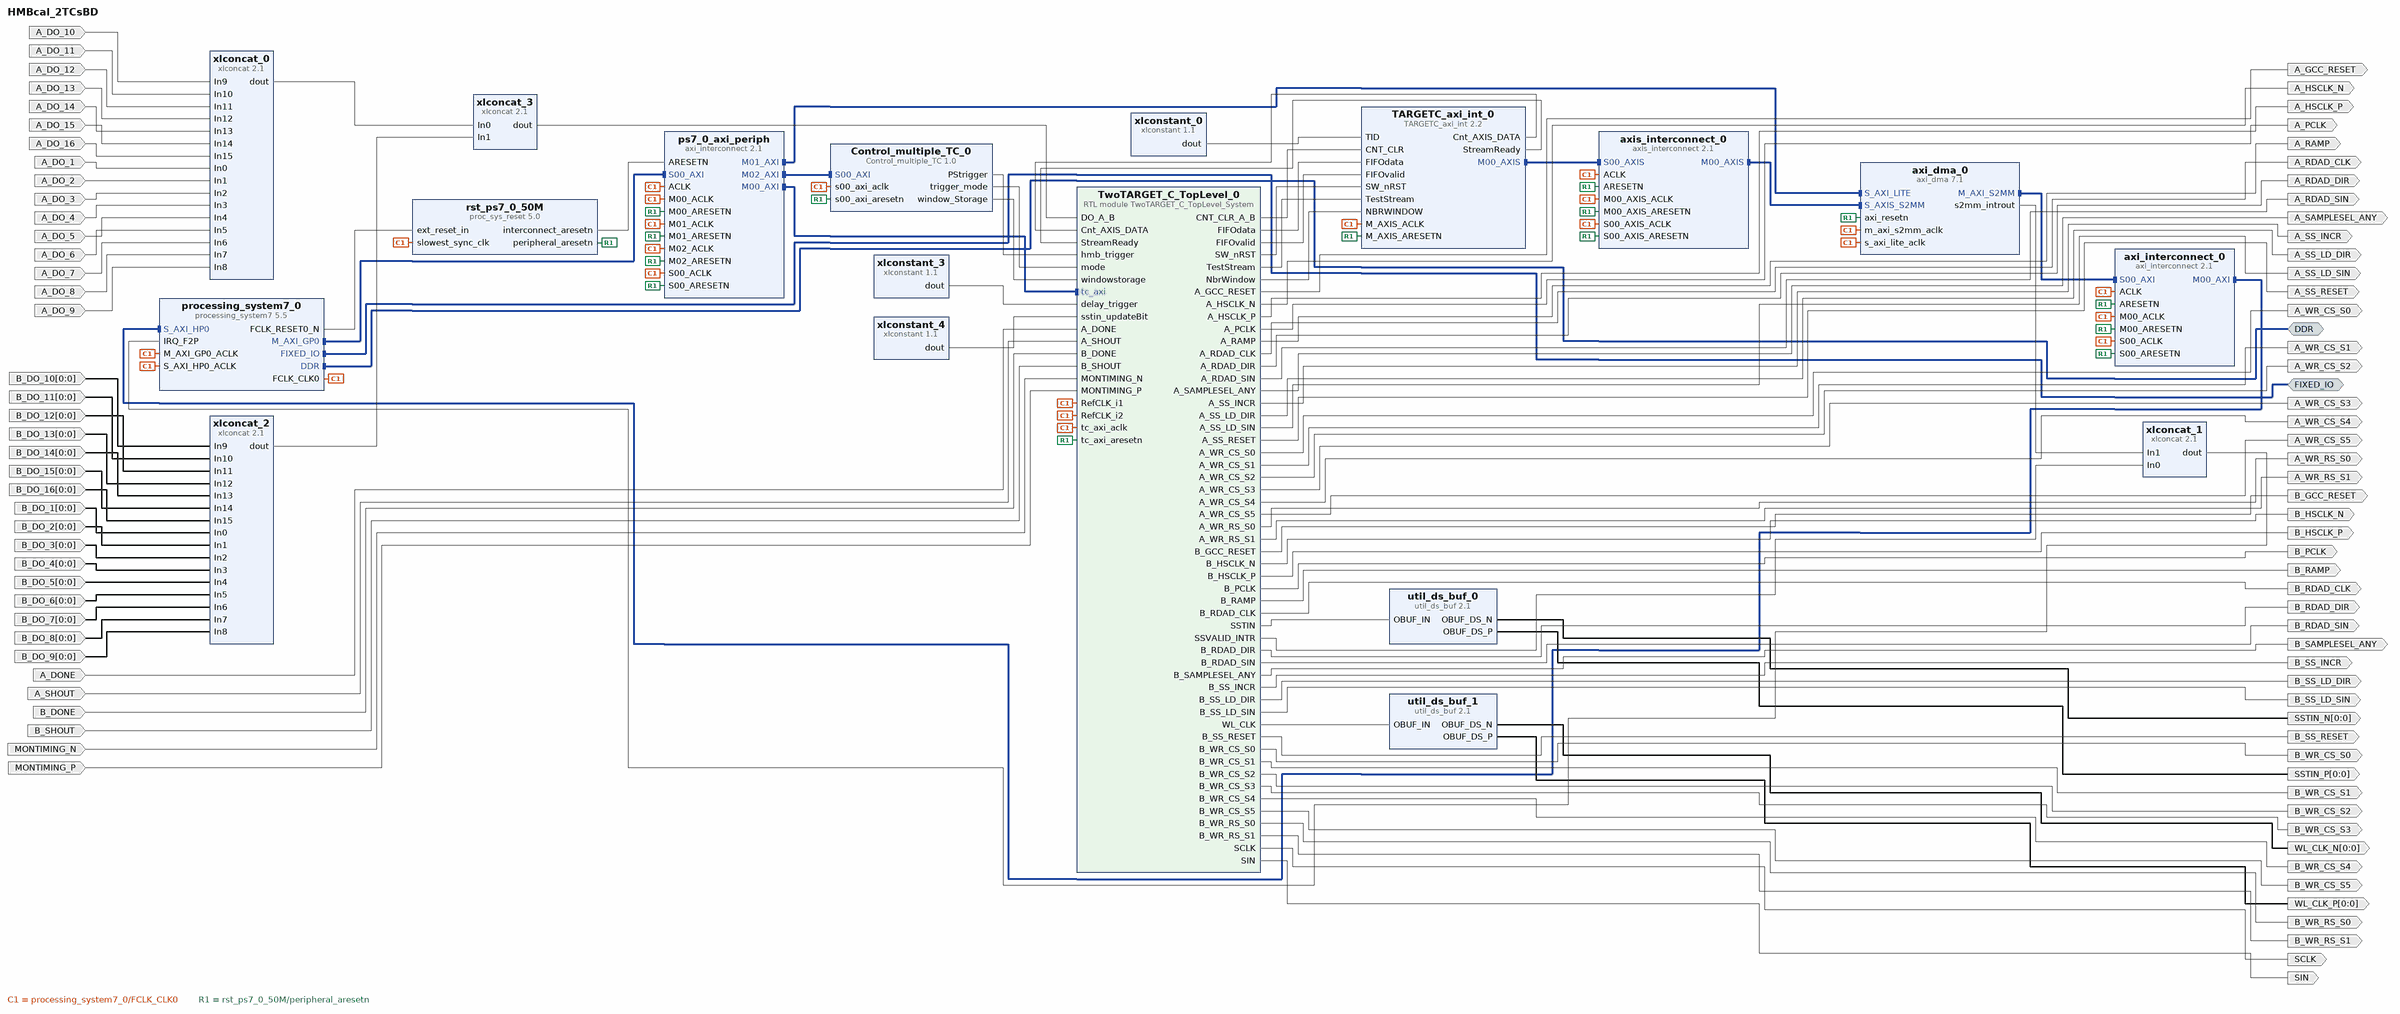
[diagram p0: block diagram of the top level]
# Vivado block design HMBcal_2TCsBD, xc7z020clg400-1, Vivado 2020.2
create_bd_design HMBcal_2TCsBD

create_bd_intf_port -mode Master -vlnv xilinx.com:interface:ddrx_rtl:1.0 DDR
create_bd_intf_port -mode Master -vlnv xilinx.com:display_processing_system7:fixedio_rtl:1.0 FIXED_IO
create_bd_port -dir I A_DONE
create_bd_port -dir I A_DO_1
create_bd_port -dir I A_DO_2
create_bd_port -dir I A_DO_3
create_bd_port -dir I A_DO_4
create_bd_port -dir I A_DO_5
create_bd_port -dir I A_DO_6
create_bd_port -dir I A_DO_7
create_bd_port -dir I A_DO_8
create_bd_port -dir I A_DO_9
create_bd_port -dir I A_DO_10
create_bd_port -dir I A_DO_11
create_bd_port -dir I A_DO_12
create_bd_port -dir I A_DO_13
create_bd_port -dir I A_DO_14
create_bd_port -dir I A_DO_15
create_bd_port -dir I A_DO_16
create_bd_port -dir O A_GCC_RESET
create_bd_port -dir O A_HSCLK_N
create_bd_port -dir O A_HSCLK_P
create_bd_port -dir O A_PCLK
create_bd_port -dir O A_RAMP
create_bd_port -dir O A_RDAD_CLK
create_bd_port -dir O A_RDAD_DIR
create_bd_port -dir O A_RDAD_SIN
create_bd_port -dir O A_SAMPLESEL_ANY
create_bd_port -dir I A_SHOUT
create_bd_port -dir O A_SS_INCR
create_bd_port -dir O A_SS_LD_DIR
create_bd_port -dir O A_SS_LD_SIN
create_bd_port -dir O -type rst A_SS_RESET
create_bd_port -dir O A_WR_CS_S0
create_bd_port -dir O A_WR_CS_S1
create_bd_port -dir O A_WR_CS_S2
create_bd_port -dir O A_WR_CS_S3
create_bd_port -dir O A_WR_CS_S4
create_bd_port -dir O A_WR_CS_S5
create_bd_port -dir O A_WR_RS_S0
create_bd_port -dir O A_WR_RS_S1
create_bd_port -dir I B_DONE
create_bd_port -dir I -from 0 -to 0 B_DO_1
create_bd_port -dir I -from 0 -to 0 B_DO_2
create_bd_port -dir I -from 0 -to 0 -type data B_DO_3
create_bd_port -dir I -from 0 -to 0 -type data B_DO_4
create_bd_port -dir I -from 0 -to 0 -type data B_DO_5
create_bd_port -dir I -from 0 -to 0 -type data B_DO_6
create_bd_port -dir I -from 0 -to 0 -type data B_DO_7
create_bd_port -dir I -from 0 -to 0 -type data B_DO_8
create_bd_port -dir I -from 0 -to 0 -type data B_DO_9
create_bd_port -dir I -from 0 -to 0 -type data B_DO_10
create_bd_port -dir I -from 0 -to 0 -type data B_DO_11
create_bd_port -dir I -from 0 -to 0 B_DO_12
create_bd_port -dir I -from 0 -to 0 -type data B_DO_13
create_bd_port -dir I -from 0 -to 0 -type data B_DO_14
create_bd_port -dir I -from 0 -to 0 -type data B_DO_15
create_bd_port -dir I -from 0 -to 0 -type data B_DO_16
create_bd_port -dir O -type data B_GCC_RESET
create_bd_port -dir O -type data B_HSCLK_N
create_bd_port -dir O -type data B_HSCLK_P
create_bd_port -dir O B_PCLK
create_bd_port -dir O -type data B_RAMP
create_bd_port -dir O -type data B_RDAD_CLK
create_bd_port -dir O -type data B_RDAD_DIR
create_bd_port -dir O -type data B_RDAD_SIN
create_bd_port -dir O -type data B_SAMPLESEL_ANY
create_bd_port -dir I B_SHOUT
create_bd_port -dir O -type data B_SS_INCR
create_bd_port -dir O -type clk B_SS_LD_DIR
create_bd_port -dir O -type clk B_SS_LD_SIN
create_bd_port -dir O -type rst B_SS_RESET
create_bd_port -dir O -type data B_WR_CS_S0
create_bd_port -dir O -type data B_WR_CS_S1
create_bd_port -dir O -type data B_WR_CS_S2
create_bd_port -dir O -type data B_WR_CS_S3
create_bd_port -dir O -type data B_WR_CS_S4
create_bd_port -dir O B_WR_CS_S5
create_bd_port -dir O B_WR_RS_S0
create_bd_port -dir O B_WR_RS_S1
create_bd_port -dir I MONTIMING_N
create_bd_port -dir I MONTIMING_P
create_bd_port -dir O SCLK
create_bd_port -dir O SIN
create_bd_port -dir O -from 0 -to 0 SSTIN_N
create_bd_port -dir O -from 0 -to 0 SSTIN_P
create_bd_port -dir O -from 0 -to 0 -type clk WL_CLK_N
create_bd_port -dir O -from 0 -to 0 -type clk WL_CLK_P

create_bd_cell -type ip -vlnv user.org:user:Control_multiple_TC:1.0 Control_multiple_TC_0
create_bd_cell -type ip -vlnv xilinx.com:ip:axi_dma:7.1 axi_dma_0
set_property -dict [list \
  CONFIG.c_include_mm2s 0 \
  CONFIG.c_include_s2mm 1 \
  CONFIG.c_include_s2mm_dre 0 \
  CONFIG.c_include_sg 0 \
  CONFIG.c_micro_dma 0 \
  CONFIG.c_s2mm_burst_size 128 \
  CONFIG.c_sg_length_width 14 \
] [get_bd_cells axi_dma_0]
create_bd_cell -type ip -vlnv xilinx.com:ip:axi_interconnect:2.1 axi_interconnect_0
set_property -dict {CONFIG.ENABLE_ADVANCED_OPTIONS 0 CONFIG.NUM_MI 1} [get_bd_cells axi_interconnect_0]
create_bd_cell -type ip -vlnv xilinx.com:ip:axis_interconnect:2.1 axis_interconnect_0
set_property -dict [list \
  CONFIG.ARB_ON_MAX_XFERS 0 \
  CONFIG.ARB_ON_TLAST 0 \
  CONFIG.ENABLE_ADVANCED_OPTIONS 0 \
  CONFIG.M00_FIFO_DEPTH 64 \
  CONFIG.M00_FIFO_MODE 0 \
  CONFIG.NUM_MI 1 \
  CONFIG.NUM_SI 1 \
  CONFIG.S00_FIFO_DEPTH 32 \
  CONFIG.S01_FIFO_DEPTH 32 \
] [get_bd_cells axis_interconnect_0]
create_bd_cell -type ip -vlnv xilinx.com:ip:processing_system7:5.5 processing_system7_0
set_property -dict [list \
  CONFIG.PCW_APU_PERIPHERAL_FREQMHZ 666.666666 \
  CONFIG.PCW_ENET0_ENET0_IO {MIO 16 .. 27} \
  CONFIG.PCW_ENET0_GRP_MDIO_ENABLE 1 \
  CONFIG.PCW_ENET0_GRP_MDIO_IO {MIO 52 .. 53} \
  CONFIG.PCW_ENET0_PERIPHERAL_ENABLE 1 \
  CONFIG.PCW_ENET0_PERIPHERAL_FREQMHZ {100 Mbps} \
  CONFIG.PCW_ENET0_RESET_ENABLE 0 \
  CONFIG.PCW_ENET_RESET_ENABLE 1 \
  CONFIG.PCW_ENET_RESET_SELECT {Share reset pin} \
  CONFIG.PCW_FPGA0_PERIPHERAL_FREQMHZ 125 \
  CONFIG.PCW_FPGA1_PERIPHERAL_FREQMHZ 100 \
  CONFIG.PCW_GPIO_MIO_GPIO_ENABLE 1 \
  CONFIG.PCW_GPIO_MIO_GPIO_IO MIO \
  CONFIG.PCW_I2C_RESET_ENABLE 0 \
  CONFIG.PCW_IRQ_F2P_INTR 1 \
  CONFIG.PCW_PERIPHERAL_BOARD_PRESET part0 \
  CONFIG.PCW_PRESET_BANK1_VOLTAGE {LVCMOS 1.8V} \
  CONFIG.PCW_QSPI_GRP_FBCLK_ENABLE 1 \
  CONFIG.PCW_QSPI_GRP_FBCLK_IO {MIO 8} \
  CONFIG.PCW_QSPI_GRP_SINGLE_SS_ENABLE 1 \
  CONFIG.PCW_QSPI_GRP_SINGLE_SS_IO {MIO 1 .. 6} \
  CONFIG.PCW_QSPI_PERIPHERAL_ENABLE 1 \
  CONFIG.PCW_QSPI_QSPI_IO {MIO 1 .. 6} \
  CONFIG.PCW_SD0_GRP_CD_ENABLE 1 \
  CONFIG.PCW_SD0_GRP_CD_IO {MIO 46} \
  CONFIG.PCW_SD0_GRP_WP_ENABLE 1 \
  CONFIG.PCW_SD0_GRP_WP_IO {MIO 50} \
  CONFIG.PCW_SD0_PERIPHERAL_ENABLE 1 \
  CONFIG.PCW_SD0_SD0_IO {MIO 40 .. 45} \
  CONFIG.PCW_SDIO_PERIPHERAL_FREQMHZ 50 \
  CONFIG.PCW_SINGLE_QSPI_DATA_MODE x4 \
  CONFIG.PCW_S_AXI_HP0_DATA_WIDTH 32 \
  CONFIG.PCW_TTC0_PERIPHERAL_ENABLE 1 \
  CONFIG.PCW_TTC0_TTC0_IO EMIO \
  CONFIG.PCW_UART1_PERIPHERAL_ENABLE 1 \
  CONFIG.PCW_UART1_UART1_IO {MIO 48 .. 49} \
  CONFIG.PCW_UART_PERIPHERAL_FREQMHZ 50 \
  CONFIG.PCW_UIPARAM_DDR_FREQ_MHZ 533.333333 \
  CONFIG.PCW_UIPARAM_DDR_PARTNO {MT41K256M16 RE-125} \
  CONFIG.PCW_USB0_PERIPHERAL_ENABLE 0 \
  CONFIG.PCW_USB_RESET_ENABLE 1 \
  CONFIG.PCW_USE_FABRIC_INTERRUPT 1 \
  CONFIG.PCW_USE_S_AXI_HP0 1 \
  CONFIG.preset ZC702 \
] [get_bd_cells processing_system7_0]
# 511 more settings of processing_system7_0 are not shown: defaults, MIO pin electricals, DDR timing, and values the tool derives
create_bd_cell -type ip -vlnv xilinx.com:ip:axi_interconnect:2.1 ps7_0_axi_periph
set_property -dict {CONFIG.NUM_MI 3 CONFIG.NUM_SI 1} [get_bd_cells ps7_0_axi_periph]
create_bd_cell -type ip -vlnv xilinx.com:ip:util_ds_buf:2.1 util_ds_buf_0
set_property -dict {CONFIG.C_BUF_TYPE OBUFDS} [get_bd_cells util_ds_buf_0]
create_bd_cell -type ip -vlnv xilinx.com:ip:util_ds_buf:2.1 util_ds_buf_1
set_property -dict {CONFIG.C_BUF_TYPE OBUFDS} [get_bd_cells util_ds_buf_1]
create_bd_cell -type ip -vlnv xilinx.com:ip:xlconcat:2.1 xlconcat_0
set_property -dict {CONFIG.NUM_PORTS 16} [get_bd_cells xlconcat_0]
create_bd_cell -type ip -vlnv xilinx.com:ip:xlconcat:2.1 xlconcat_1
set_property -dict {CONFIG.NUM_PORTS 2} [get_bd_cells xlconcat_1]
create_bd_cell -type ip -vlnv xilinx.com:ip:xlconcat:2.1 xlconcat_2
set_property -dict {CONFIG.NUM_PORTS 16} [get_bd_cells xlconcat_2]
create_bd_cell -type ip -vlnv xilinx.com:ip:xlconcat:2.1 xlconcat_3
set_property -dict {CONFIG.IN0_WIDTH 16 CONFIG.IN1_WIDTH 16 CONFIG.NUM_PORTS 2} [get_bd_cells xlconcat_3]
create_bd_cell -type ip -vlnv xilinx.com:ip:xlconstant:1.1 xlconstant_0
set_property -dict {CONFIG.CONST_VAL 0 CONFIG.CONST_WIDTH 2} [get_bd_cells xlconstant_0]
create_bd_cell -type ip -vlnv xilinx.com:ip:xlconstant:1.1 xlconstant_3
set_property -dict {CONFIG.CONST_WIDTH 4} [get_bd_cells xlconstant_3]
create_bd_cell -type ip -vlnv xilinx.com:ip:xlconstant:1.1 xlconstant_4
set_property -dict {CONFIG.CONST_VAL 3 CONFIG.CONST_WIDTH 3} [get_bd_cells xlconstant_4]
create_bd_cell -type ip -vlnv xilinx.com:ip:proc_sys_reset:5.0 rst_ps7_0_50M
create_bd_cell -type ip -vlnv user.org:user:TARGETC_axi_int:2.2 TARGETC_axi_int_0
set_property -dict {CONFIG.FIFO_NBR_MAX 1030 CONFIG.NBRWINDOW_MAX 8} [get_bd_cells TARGETC_axi_int_0]
create_bd_cell -type module -reference TwoTARGET_C_TopLevel_System TwoTARGET_C_TopLevel_0

# ---- connections ----

connect_bd_intf_net [get_bd_intf_pins TARGETC_axi_int_0/M00_AXIS] [get_bd_intf_pins axis_interconnect_0/S00_AXIS]
connect_bd_intf_net [get_bd_intf_ports FIXED_IO] [get_bd_intf_pins processing_system7_0/FIXED_IO]
connect_bd_intf_net [get_bd_intf_pins processing_system7_0/M_AXI_GP0] [get_bd_intf_pins ps7_0_axi_periph/S00_AXI]
connect_bd_intf_net [get_bd_intf_pins axi_dma_0/S_AXI_LITE] [get_bd_intf_pins ps7_0_axi_periph/M01_AXI]
connect_bd_intf_net [get_bd_intf_pins Control_multiple_TC_0/S00_AXI] [get_bd_intf_pins ps7_0_axi_periph/M02_AXI]
connect_bd_intf_net [get_bd_intf_ports DDR] [get_bd_intf_pins processing_system7_0/DDR]
connect_bd_intf_net [get_bd_intf_pins axi_dma_0/M_AXI_S2MM] [get_bd_intf_pins axi_interconnect_0/S00_AXI]
connect_bd_intf_net [get_bd_intf_pins TwoTARGET_C_TopLevel_0/tc_axi] [get_bd_intf_pins ps7_0_axi_periph/M00_AXI]
connect_bd_intf_net [get_bd_intf_pins axi_interconnect_0/M00_AXI] [get_bd_intf_pins processing_system7_0/S_AXI_HP0]
connect_bd_intf_net [get_bd_intf_pins axi_dma_0/S_AXIS_S2MM] [get_bd_intf_pins axis_interconnect_0/M00_AXIS]
connect_bd_net -net B_DO_10_1 [get_bd_ports B_DO_10] [get_bd_pins xlconcat_2/In9]
connect_bd_net -net B_DO_11_1 [get_bd_ports B_DO_11] [get_bd_pins xlconcat_2/In10]
connect_bd_net -net B_DO_12_1 [get_bd_ports B_DO_12] [get_bd_pins xlconcat_2/In11]
connect_bd_net [get_bd_ports B_DO_13] [get_bd_pins xlconcat_2/In12]
connect_bd_net -net B_DO_14_1 [get_bd_ports B_DO_14] [get_bd_pins xlconcat_2/In13]
connect_bd_net -net B_DO_15_1 [get_bd_ports B_DO_15] [get_bd_pins xlconcat_2/In14]
connect_bd_net -net B_DO_16_1 [get_bd_ports B_DO_16] [get_bd_pins xlconcat_2/In15]
connect_bd_net -net B_DO_1_1 [get_bd_ports B_DO_1] [get_bd_pins xlconcat_2/In0]
connect_bd_net -net B_DO_2_1 [get_bd_ports B_DO_2] [get_bd_pins xlconcat_2/In1]
connect_bd_net -net B_DO_3_1 [get_bd_ports B_DO_3] [get_bd_pins xlconcat_2/In2]
connect_bd_net -net B_DO_4_1 [get_bd_ports B_DO_4] [get_bd_pins xlconcat_2/In3]
connect_bd_net -net B_DO_5_1 [get_bd_ports B_DO_5] [get_bd_pins xlconcat_2/In4]
connect_bd_net -net B_DO_6_1 [get_bd_ports B_DO_6] [get_bd_pins xlconcat_2/In5]
connect_bd_net -net B_DO_7_1 [get_bd_ports B_DO_7] [get_bd_pins xlconcat_2/In6]
connect_bd_net -net B_DO_8_1 [get_bd_ports B_DO_8] [get_bd_pins xlconcat_2/In7]
connect_bd_net -net B_DO_9_1 [get_bd_ports B_DO_9] [get_bd_pins xlconcat_2/In8]
connect_bd_net -net Control_multiple_TC_0_PStrigger [get_bd_pins Control_multiple_TC_0/PStrigger] [get_bd_pins TwoTARGET_C_TopLevel_0/hmb_trigger]
connect_bd_net [get_bd_pins Control_multiple_TC_0/trigger_mode] [get_bd_pins TwoTARGET_C_TopLevel_0/mode]
connect_bd_net [get_bd_pins Control_multiple_TC_0/window_Storage] [get_bd_pins TwoTARGET_C_TopLevel_0/windowstorage]
connect_bd_net -net DO_10_1 [get_bd_ports A_DO_10] [get_bd_pins xlconcat_0/In9]
connect_bd_net -net DO_11_1 [get_bd_ports A_DO_11] [get_bd_pins xlconcat_0/In10]
connect_bd_net -net DO_12_1 [get_bd_ports A_DO_12] [get_bd_pins xlconcat_0/In11]
connect_bd_net -net DO_13_1 [get_bd_ports A_DO_13] [get_bd_pins xlconcat_0/In12]
connect_bd_net -net DO_14_1 [get_bd_ports A_DO_14] [get_bd_pins xlconcat_0/In13]
connect_bd_net -net DO_15_1 [get_bd_ports A_DO_15] [get_bd_pins xlconcat_0/In14]
connect_bd_net -net DO_16_1 [get_bd_ports A_DO_16] [get_bd_pins xlconcat_0/In15]
connect_bd_net -net DO_1_1 [get_bd_ports A_DO_1] [get_bd_pins xlconcat_0/In0]
connect_bd_net -net DO_2_1 [get_bd_ports A_DO_2] [get_bd_pins xlconcat_0/In1]
connect_bd_net -net DO_3_1 [get_bd_ports A_DO_3] [get_bd_pins xlconcat_0/In2]
connect_bd_net -net DO_4_1 [get_bd_ports A_DO_4] [get_bd_pins xlconcat_0/In3]
connect_bd_net -net DO_5_1 [get_bd_ports A_DO_5] [get_bd_pins xlconcat_0/In4]
connect_bd_net -net DO_6_1 [get_bd_ports A_DO_6] [get_bd_pins xlconcat_0/In5]
connect_bd_net -net DO_7_1 [get_bd_ports A_DO_7] [get_bd_pins xlconcat_0/In6]
connect_bd_net -net DO_8_1 [get_bd_ports A_DO_8] [get_bd_pins xlconcat_0/In7]
connect_bd_net -net DO_9_1 [get_bd_ports A_DO_9] [get_bd_pins xlconcat_0/In8]
connect_bd_net [get_bd_pins TARGETC_axi_int_0/Cnt_AXIS_DATA] [get_bd_pins TwoTARGET_C_TopLevel_0/Cnt_AXIS_DATA]
connect_bd_net [get_bd_pins TARGETC_axi_int_0/StreamReady] [get_bd_pins TwoTARGET_C_TopLevel_0/StreamReady]
connect_bd_net -net TwoTARGET_C_TopLevel_0_A_DONE [get_bd_ports A_DONE] [get_bd_pins TwoTARGET_C_TopLevel_0/A_DONE]
connect_bd_net [get_bd_pins TwoTARGET_C_TopLevel_0/A_GCC_RESET] [get_bd_ports A_GCC_RESET]
connect_bd_net [get_bd_pins TwoTARGET_C_TopLevel_0/A_HSCLK_N] [get_bd_ports A_HSCLK_N]
connect_bd_net [get_bd_pins TwoTARGET_C_TopLevel_0/A_HSCLK_P] [get_bd_ports A_HSCLK_P]
connect_bd_net [get_bd_pins TwoTARGET_C_TopLevel_0/A_PCLK] [get_bd_ports A_PCLK]
connect_bd_net [get_bd_pins TwoTARGET_C_TopLevel_0/A_RAMP] [get_bd_ports A_RAMP]
connect_bd_net [get_bd_pins TwoTARGET_C_TopLevel_0/A_RDAD_CLK] [get_bd_ports A_RDAD_CLK]
connect_bd_net [get_bd_pins TwoTARGET_C_TopLevel_0/A_RDAD_DIR] [get_bd_ports A_RDAD_DIR]
connect_bd_net [get_bd_pins TwoTARGET_C_TopLevel_0/A_RDAD_SIN] [get_bd_ports A_RDAD_SIN]
connect_bd_net [get_bd_pins TwoTARGET_C_TopLevel_0/A_SAMPLESEL_ANY] [get_bd_ports A_SAMPLESEL_ANY]
connect_bd_net -net TwoTARGET_C_TopLevel_0_A_SHOUT [get_bd_ports A_SHOUT] [get_bd_pins TwoTARGET_C_TopLevel_0/A_SHOUT]
connect_bd_net [get_bd_pins TwoTARGET_C_TopLevel_0/A_SS_INCR] [get_bd_ports A_SS_INCR]
connect_bd_net [get_bd_pins TwoTARGET_C_TopLevel_0/A_SS_LD_DIR] [get_bd_ports A_SS_LD_DIR]
connect_bd_net [get_bd_pins TwoTARGET_C_TopLevel_0/A_SS_LD_SIN] [get_bd_ports A_SS_LD_SIN]
connect_bd_net [get_bd_pins TwoTARGET_C_TopLevel_0/A_SS_RESET] [get_bd_ports A_SS_RESET]
connect_bd_net [get_bd_pins TwoTARGET_C_TopLevel_0/A_WR_CS_S0] [get_bd_ports A_WR_CS_S0]
connect_bd_net [get_bd_pins TwoTARGET_C_TopLevel_0/A_WR_CS_S1] [get_bd_ports A_WR_CS_S1]
connect_bd_net [get_bd_pins TwoTARGET_C_TopLevel_0/A_WR_CS_S2] [get_bd_ports A_WR_CS_S2]
connect_bd_net [get_bd_pins TwoTARGET_C_TopLevel_0/A_WR_CS_S3] [get_bd_ports A_WR_CS_S3]
connect_bd_net [get_bd_pins TwoTARGET_C_TopLevel_0/A_WR_CS_S4] [get_bd_ports A_WR_CS_S4]
connect_bd_net [get_bd_pins TwoTARGET_C_TopLevel_0/A_WR_CS_S5] [get_bd_ports A_WR_CS_S5]
connect_bd_net [get_bd_pins TwoTARGET_C_TopLevel_0/A_WR_RS_S0] [get_bd_ports A_WR_RS_S0]
connect_bd_net [get_bd_pins TwoTARGET_C_TopLevel_0/A_WR_RS_S1] [get_bd_ports A_WR_RS_S1]
connect_bd_net -net TwoTARGET_C_TopLevel_0_B_DONE [get_bd_ports B_DONE] [get_bd_pins TwoTARGET_C_TopLevel_0/B_DONE]
connect_bd_net [get_bd_pins TwoTARGET_C_TopLevel_0/B_GCC_RESET] [get_bd_ports B_GCC_RESET]
connect_bd_net [get_bd_pins TwoTARGET_C_TopLevel_0/B_HSCLK_N] [get_bd_ports B_HSCLK_N]
connect_bd_net [get_bd_pins TwoTARGET_C_TopLevel_0/B_HSCLK_P] [get_bd_ports B_HSCLK_P]
connect_bd_net [get_bd_pins TwoTARGET_C_TopLevel_0/B_PCLK] [get_bd_ports B_PCLK]
connect_bd_net [get_bd_pins TwoTARGET_C_TopLevel_0/B_RAMP] [get_bd_ports B_RAMP]
connect_bd_net [get_bd_pins TwoTARGET_C_TopLevel_0/B_RDAD_CLK] [get_bd_ports B_RDAD_CLK]
connect_bd_net [get_bd_pins TwoTARGET_C_TopLevel_0/B_RDAD_DIR] [get_bd_ports B_RDAD_DIR]
connect_bd_net [get_bd_pins TwoTARGET_C_TopLevel_0/B_RDAD_SIN] [get_bd_ports B_RDAD_SIN]
connect_bd_net [get_bd_pins TwoTARGET_C_TopLevel_0/B_SAMPLESEL_ANY] [get_bd_ports B_SAMPLESEL_ANY]
connect_bd_net -net TwoTARGET_C_TopLevel_0_B_SHOUT [get_bd_ports B_SHOUT] [get_bd_pins TwoTARGET_C_TopLevel_0/B_SHOUT]
connect_bd_net [get_bd_pins TwoTARGET_C_TopLevel_0/B_SS_INCR] [get_bd_ports B_SS_INCR]
connect_bd_net [get_bd_pins TwoTARGET_C_TopLevel_0/B_SS_LD_DIR] [get_bd_ports B_SS_LD_DIR]
connect_bd_net [get_bd_pins TwoTARGET_C_TopLevel_0/B_SS_LD_SIN] [get_bd_ports B_SS_LD_SIN]
connect_bd_net [get_bd_pins TwoTARGET_C_TopLevel_0/B_SS_RESET] [get_bd_ports B_SS_RESET]
connect_bd_net [get_bd_pins TwoTARGET_C_TopLevel_0/B_WR_CS_S0] [get_bd_ports B_WR_CS_S0]
connect_bd_net [get_bd_pins TwoTARGET_C_TopLevel_0/B_WR_CS_S1] [get_bd_ports B_WR_CS_S1]
connect_bd_net [get_bd_pins TwoTARGET_C_TopLevel_0/B_WR_CS_S2] [get_bd_ports B_WR_CS_S2]
connect_bd_net [get_bd_pins TwoTARGET_C_TopLevel_0/B_WR_CS_S3] [get_bd_ports B_WR_CS_S3]
connect_bd_net [get_bd_pins TwoTARGET_C_TopLevel_0/B_WR_CS_S4] [get_bd_ports B_WR_CS_S4]
connect_bd_net [get_bd_pins TwoTARGET_C_TopLevel_0/B_WR_CS_S5] [get_bd_ports B_WR_CS_S5]
connect_bd_net [get_bd_pins TwoTARGET_C_TopLevel_0/B_WR_RS_S0] [get_bd_ports B_WR_RS_S0]
connect_bd_net [get_bd_pins TwoTARGET_C_TopLevel_0/B_WR_RS_S1] [get_bd_ports B_WR_RS_S1]
connect_bd_net [get_bd_pins TwoTARGET_C_TopLevel_0/CNT_CLR_A_B] [get_bd_pins TARGETC_axi_int_0/CNT_CLR]
connect_bd_net [get_bd_pins TwoTARGET_C_TopLevel_0/FIFOdata] [get_bd_pins TARGETC_axi_int_0/FIFOdata]
connect_bd_net [get_bd_pins TwoTARGET_C_TopLevel_0/FIFOvalid] [get_bd_pins TARGETC_axi_int_0/FIFOvalid]
connect_bd_net -net TwoTARGET_C_TopLevel_0_MONTIMING_N [get_bd_ports MONTIMING_N] [get_bd_pins TwoTARGET_C_TopLevel_0/MONTIMING_N]
connect_bd_net -net TwoTARGET_C_TopLevel_0_MONTIMING_P [get_bd_ports MONTIMING_P] [get_bd_pins TwoTARGET_C_TopLevel_0/MONTIMING_P]
connect_bd_net [get_bd_pins TwoTARGET_C_TopLevel_0/SCLK] [get_bd_ports SCLK]
connect_bd_net [get_bd_pins TwoTARGET_C_TopLevel_0/SIN] [get_bd_ports SIN]
connect_bd_net [get_bd_pins TwoTARGET_C_TopLevel_0/SSTIN] [get_bd_pins util_ds_buf_0/OBUF_IN]
connect_bd_net [get_bd_pins TwoTARGET_C_TopLevel_0/SSVALID_INTR] [get_bd_pins xlconcat_1/In0]
connect_bd_net [get_bd_pins TwoTARGET_C_TopLevel_0/SW_nRST] [get_bd_pins TARGETC_axi_int_0/SW_nRST]
connect_bd_net [get_bd_pins TwoTARGET_C_TopLevel_0/TestStream] [get_bd_pins TARGETC_axi_int_0/TestStream]
connect_bd_net [get_bd_pins TwoTARGET_C_TopLevel_0/WL_CLK] [get_bd_pins util_ds_buf_1/OBUF_IN]
connect_bd_net [get_bd_pins axi_dma_0/s2mm_introut] [get_bd_pins xlconcat_1/In1]
connect_bd_net [get_bd_pins processing_system7_0/FCLK_CLK0] \
  [get_bd_pins Control_multiple_TC_0/s00_axi_aclk] [get_bd_pins axi_dma_0/m_axi_s2mm_aclk] \
  [get_bd_pins axi_dma_0/s_axi_lite_aclk] [get_bd_pins axi_interconnect_0/ACLK] [get_bd_pins axi_interconnect_0/M00_ACLK] \
  [get_bd_pins axi_interconnect_0/S00_ACLK] [get_bd_pins axis_interconnect_0/ACLK] \
  [get_bd_pins axis_interconnect_0/M00_AXIS_ACLK] [get_bd_pins axis_interconnect_0/S00_AXIS_ACLK] \
  [get_bd_pins processing_system7_0/M_AXI_GP0_ACLK] [get_bd_pins processing_system7_0/S_AXI_HP0_ACLK] \
  [get_bd_pins ps7_0_axi_periph/ACLK] [get_bd_pins ps7_0_axi_periph/M00_ACLK] [get_bd_pins ps7_0_axi_periph/M01_ACLK] \
  [get_bd_pins ps7_0_axi_periph/M02_ACLK] [get_bd_pins ps7_0_axi_periph/S00_ACLK] \
  [get_bd_pins rst_ps7_0_50M/slowest_sync_clk] [get_bd_pins TARGETC_axi_int_0/M_AXIS_ACLK] \
  [get_bd_pins TwoTARGET_C_TopLevel_0/RefCLK_i1] [get_bd_pins TwoTARGET_C_TopLevel_0/RefCLK_i2] \
  [get_bd_pins TwoTARGET_C_TopLevel_0/tc_axi_aclk]
connect_bd_net [get_bd_pins rst_ps7_0_50M/peripheral_aresetn] \
  [get_bd_pins Control_multiple_TC_0/s00_axi_aresetn] [get_bd_pins axi_dma_0/axi_resetn] \
  [get_bd_pins axi_interconnect_0/ARESETN] [get_bd_pins axi_interconnect_0/M00_ARESETN] \
  [get_bd_pins axi_interconnect_0/S00_ARESETN] [get_bd_pins axis_interconnect_0/ARESETN] \
  [get_bd_pins axis_interconnect_0/M00_AXIS_ARESETN] [get_bd_pins axis_interconnect_0/S00_AXIS_ARESETN] \
  [get_bd_pins ps7_0_axi_periph/M00_ARESETN] [get_bd_pins ps7_0_axi_periph/M01_ARESETN] \
  [get_bd_pins ps7_0_axi_periph/M02_ARESETN] [get_bd_pins ps7_0_axi_periph/S00_ARESETN] \
  [get_bd_pins TARGETC_axi_int_0/M_AXIS_ARESETN] [get_bd_pins TwoTARGET_C_TopLevel_0/tc_axi_aresetn]
connect_bd_net [get_bd_pins util_ds_buf_0/OBUF_DS_N] [get_bd_ports SSTIN_N]
connect_bd_net [get_bd_pins util_ds_buf_0/OBUF_DS_P] [get_bd_ports SSTIN_P]
connect_bd_net [get_bd_pins util_ds_buf_1/OBUF_DS_N] [get_bd_ports WL_CLK_N]
connect_bd_net [get_bd_pins util_ds_buf_1/OBUF_DS_P] [get_bd_ports WL_CLK_P]
connect_bd_net [get_bd_pins xlconcat_0/dout] [get_bd_pins xlconcat_3/In0]
connect_bd_net [get_bd_pins xlconcat_1/dout] [get_bd_pins processing_system7_0/IRQ_F2P]
connect_bd_net [get_bd_pins xlconcat_2/dout] [get_bd_pins xlconcat_3/In1]
connect_bd_net [get_bd_pins xlconcat_3/dout] [get_bd_pins TwoTARGET_C_TopLevel_0/DO_A_B]
connect_bd_net [get_bd_pins xlconstant_0/dout] [get_bd_pins TARGETC_axi_int_0/TID]
connect_bd_net [get_bd_pins xlconstant_3/dout] [get_bd_pins TwoTARGET_C_TopLevel_0/delay_trigger]
connect_bd_net [get_bd_pins xlconstant_4/dout] [get_bd_pins TwoTARGET_C_TopLevel_0/sstin_updateBit]
connect_bd_net -net ARESETN_1 [get_bd_pins rst_ps7_0_50M/interconnect_aresetn] [get_bd_pins ps7_0_axi_periph/ARESETN]
connect_bd_net [get_bd_pins processing_system7_0/FCLK_RESET0_N] [get_bd_pins rst_ps7_0_50M/ext_reset_in]
connect_bd_net -net TwoTARGET_C_TopLevel_0_NbrWindow [get_bd_pins TwoTARGET_C_TopLevel_0/NbrWindow] [get_bd_pins TARGETC_axi_int_0/NBRWINDOW]
set_property HDL_ATTRIBUTE.DEBUG true [get_bd_nets Control_multiple_TC_0_PStrigger]
set_property HDL_ATTRIBUTE.MARK_DEBUG true [get_bd_nets Control_multiple_TC_0_PStrigger]
set_property HDL_ATTRIBUTE.DEBUG true [get_bd_nets TwoTARGET_C_TopLevel_0_NbrWindow]
set_property HDL_ATTRIBUTE.MARK_DEBUG true [get_bd_nets TwoTARGET_C_TopLevel_0_NbrWindow]

# ---- address map ----
assign_bd_address -offset 0x00000000 -range 1G -target_address_space [get_bd_addr_spaces axi_dma_0/Data_S2MM] [get_bd_addr_segs processing_system7_0/S_AXI_HP0/HP0_DDR_LOWOCM]
assign_bd_address -offset 0x40400000 -range 64K -target_address_space [get_bd_addr_spaces processing_system7_0/Data] [get_bd_addr_segs axi_dma_0/S_AXI_LITE/Reg]
assign_bd_address -offset 0x43C00000 -range 64K -target_address_space [get_bd_addr_spaces processing_system7_0/Data] [get_bd_addr_segs Control_multiple_TC_0/S00_AXI/S00_AXI_reg]
assign_bd_address -offset 0x60000000 -range 512M -target_address_space [get_bd_addr_spaces processing_system7_0/Data] [get_bd_addr_segs TwoTARGET_C_TopLevel_0/tc_axi/reg0]

validate_bd_design
save_bd_design
